# Altium schematic sheet LED.SchDoc
size A; SheetNumber: 1; SheetTotal: 1
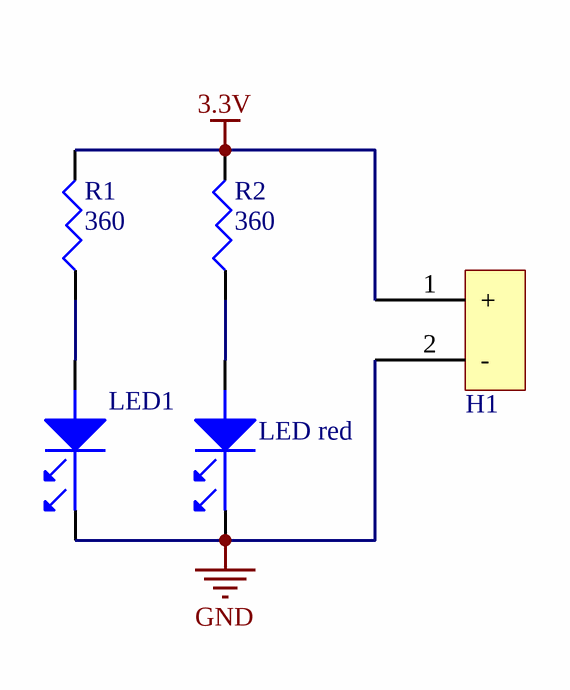
[diagram p0: LED.SchDoc]

## Parts
H1  Connector Header Through Hole 2 position  [Header 1x2]  (value not drawn)
LED1  LED red  [LED-red]  (value not drawn)
LED2  LED red  [LED-red]
R1  360  [R0805 - duplicate]
R2  360  [R0805 - duplicate]

## Nets
3.3V: H1.1(+) R1.2 R2.2
GND: H1.2(-) LED1.1 LED2.1
NetLED1_2: LED1.2 R1.1
NetLED2_2: LED2.2 R2.1

## Library data of the parts
H1 = Header  Hole 2
LED1 LED2 = LED red: Red 617nm LED Indication - Discrete 1.9V Radial
R1 R2 = Resistor: AC0805FR-07360RL